# EasyEDA Pro project 驱动圆形屏幕测试板.eprj

# Schematic 原理图

## Sheets
1 主控MCU: Board Name: 转接隔离板; Create Date: 2024-04-22; Page Name: 主控MCU; Project Name: 测试板10+10; Schematic Name: 原理图; Update Date: 2025-04-10; Company: 嘉立创EDA; Page Size: A3; Version: V1.0
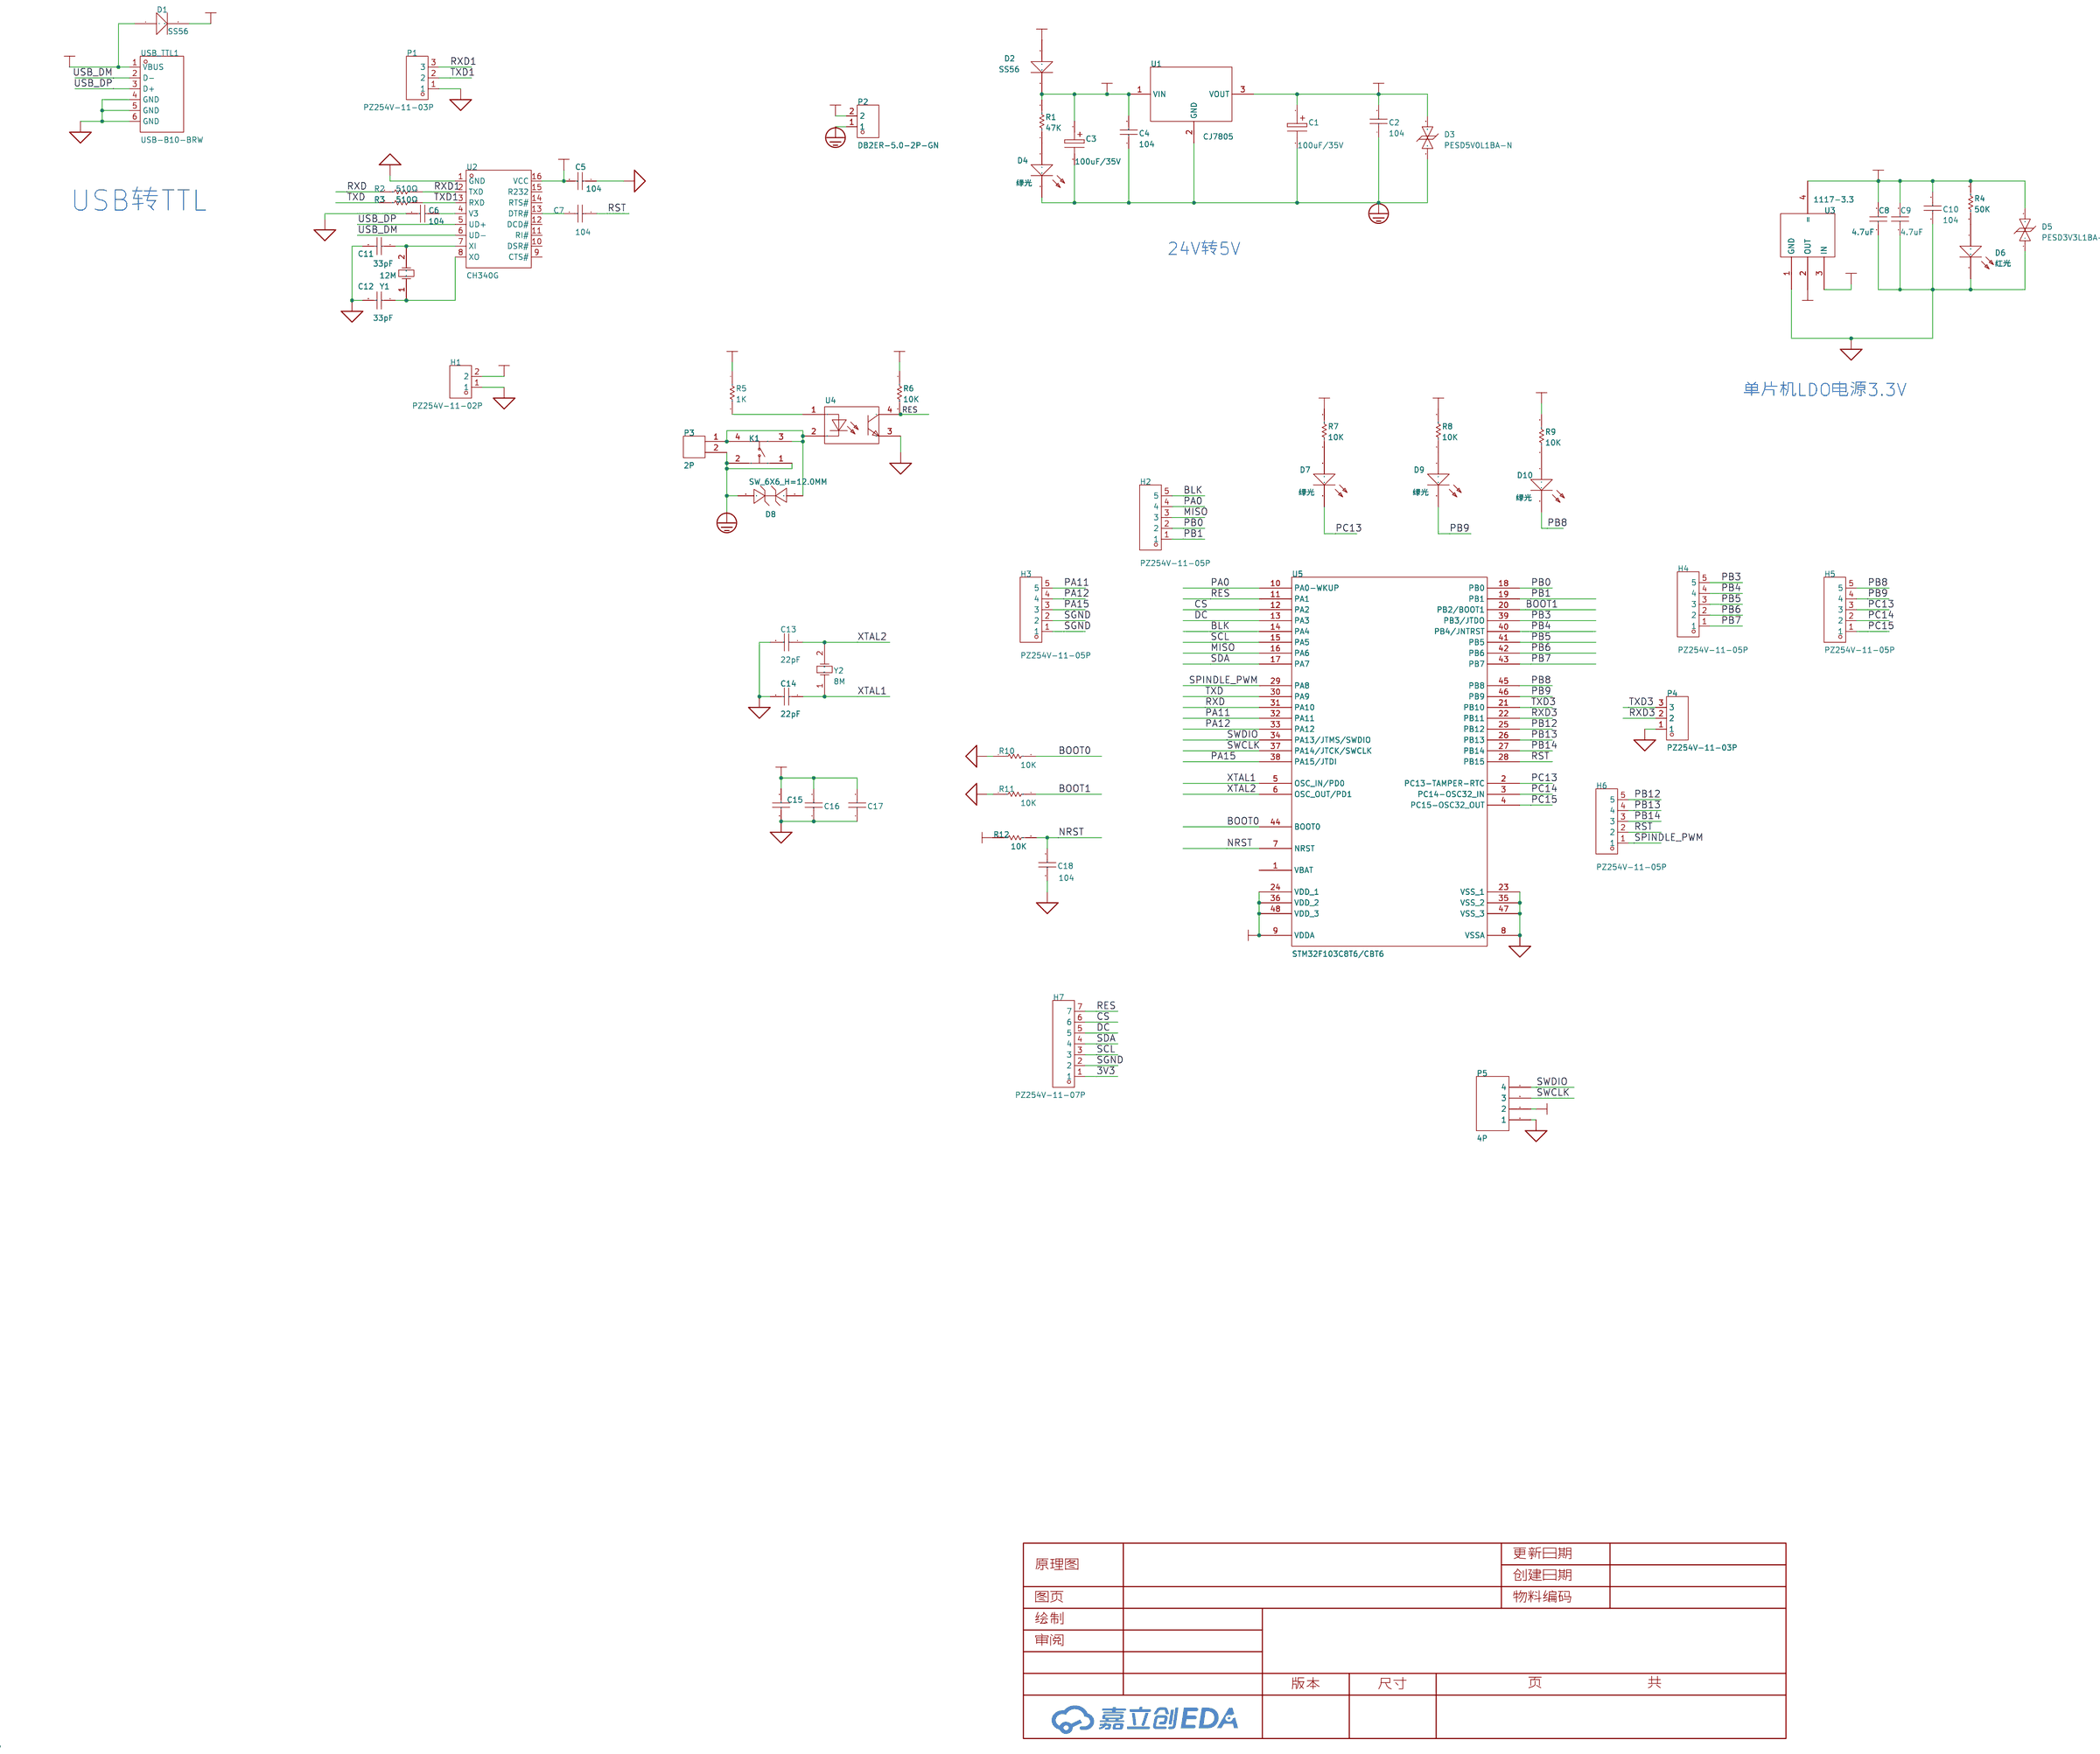
[diagram p0: 主控MCU]
2 电源及控制: Create Date: 2024-12-30; Page Name: 电源及控制; Project Name: 延时继电器; Update Date: 2025-04-08
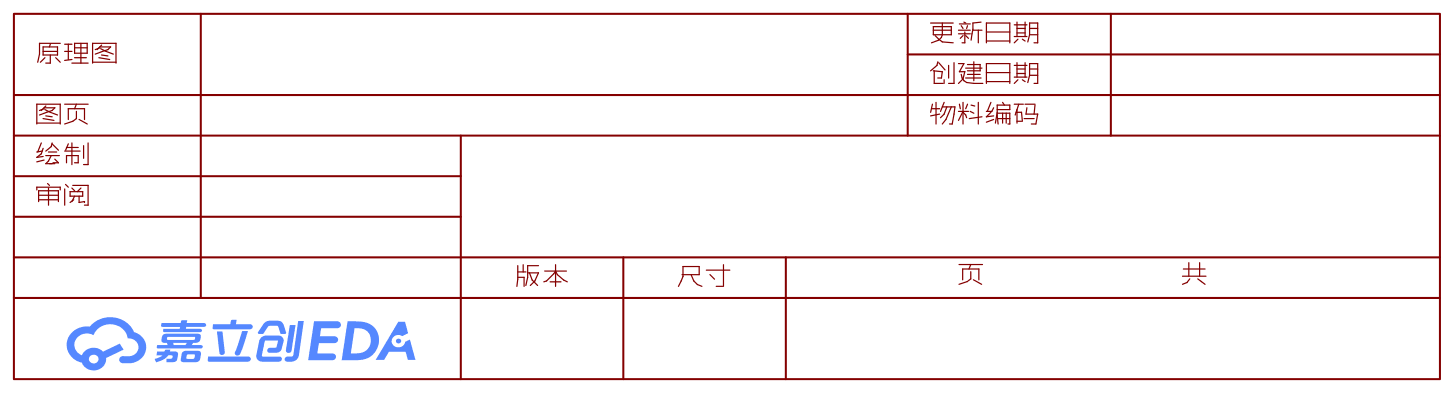
[diagram p1: 电源及控制]

## Parts
C1  100uF/35V  [电解电容贴片6X6]
C2  104  [0603C]
C3  100uF/35V  [电解电容贴片6X6]
C4  104  [0603C]
C5  104  [0603C]
C6  104  [0603C]
C7  104  [0805C]
C8  4.7uF  [C1206]
C9  4.7uF  [C1206]
C10  104  [0603C]
C11  18pF  [0603C]
C12  18pF  [0603C]
C13  100pF  [0603C]
C14  100pF  [0603C]
C15  104  [0603C]
C16  104  [0603C]
C17  104  [0603C]
C18  104  [0603C]
D1  SS56  [SMA]
D2  SS56  [SMA]
D3  PESD5V0L1BA-N  [SOD-523_L1.2-W0.8-LS1.6-BI]
D4  绿光  [0603LED]
D5  PESD3V3L1BA-N  [SOD-523_L1.2-W0.8-LS1.6-BI]
D6  红光  [0603LED]
D7  绿光  [0603LED]
D8  ESD05V52D-C  [SOD-523_L1.2-W0.8-LS1.6-BI]
D9  绿光  [0603LED]
D10  绿光  [0603LED]
H1  PZ254V-11-02P  [HDR-TH_2P-P2.54-V-M]
H2  PZ254V-11-05P  [HDR-TH_5P-P2.54-V-M]
H3  PZ254V-11-05P  [HDR-TH_5P-P2.54-V-M]
H4  PZ254V-11-05P  [HDR-TH_5P-P2.54-V-M]
H5  PZ254V-11-05P  [HDR-TH_5P-P2.54-V-M]
H6  PZ254V-11-05P  [HDR-TH_5P-P2.54-V-M]
H7  PZ254V-11-07P  [HDR-TH_7P-P2.54-V-M]
K1  SW_6X6_H=12.0MM  [KEY-SMD_4P-L6.0-W6.0-P4.50-LS9.0]
P1  PZ254V-11-03P  [HDR-TH_3P-P2.54-V-M]
P2  DB2ER-5.0-2P-GN  [CONN-TH_2P-P5.00_DB2ER-5.0-2P-GN]
P3  2P  [HDR1X2_CON]
P4  PZ254V-11-03P  [HDR-TH_3P-P2.54-V-M]
P5  4P  [SIP4]
R1  47K  [0603R]
R2  510Ω  [0603R]
R3  510Ω  [0603R]
R4  50K  [0603R]
R5  1K  [0603R]
R6  10K  [0603R]
R7  10K  [0603R]
R8  10K  [0603R]
R9  10K  [0603R]
R10  10K  [0603R]
R11  10K  [0603R]
R12  10K  [0603R]
U1  CJ7805  [TO-263-2]
U2  CH340G  [SOIC-16_L9.9-W3.9-P1.27-LS6.0-BL]
U3  1117-3.3  [SOT-223]
U4  LTV-357T-C  [SOP-4_L4.4-W3.9-P2.54-LS7.0-TL]
U5  STM32F103C8T6/CBT6  [LQFP48]
USB_TTL1  USB-B10-BRW  [USB-B-TH_USB-B12-BRW]
Y1  12M  [晶振贴片49SSMD]
Y2  8M  [晶振贴片]

## Library data of the parts
C1 C3 = 100uF/35V: Origin Footprint 2: X47U; Origin Footprint 1: 电解电容贴片6x6; Design Item ID: ELECTRO1; Library Name: *
C2 C4 C5 C10 = 104: Capacitor (Semiconductor SIM Model); Published: 8-Jun-2000; LatestRevisionDate: 17-Jul-2002; LatestRevisionNote: Re-released for DXP Platform.; PackageReference: C1206; Publisher: Altium Limited; Origin Footprint 2: C1206; Origin Footprint 3: 0402; Origin Footprint 4: 1310[0504]; Origin Footprint 5: 1608[0603]; Origin Footprint 6: C1210; Origin Footprint 7: C0805; Origin Footprint 8: C1206; Origin Footprint 9: 0805; Origin Footprint 10: 0805L; Design Item ID: Cap Semi; Library Name: Miscellaneous Devices
C6 = 103: Capacitor (Semiconductor SIM Model); Published: 8-Jun-2000; LatestRevisionDate: 17-Jul-2002; LatestRevisionNote: Re-released for DXP Platform.; PackageReference: C1206; Publisher: Altium Limited; Origin Footprint 2: C1206; Origin Footprint 3: 0402; Origin Footprint 4: 1310[0504]; Origin Footprint 5: 1608[0603]; Origin Footprint 6: C1210; Origin Footprint 7: C0805; Origin Footprint 8: C1206; Origin Footprint 9: 0805; Origin Footprint 10: 0805L; Design Item ID: Cap Semi; Library Name: Miscellaneous Devices
C7 = 104: Capacitor (Semiconductor SIM Model); Published: 8-Jun-2000; LatestRevisionDate: 17-Jul-2002; LatestRevisionNote: Re-released for DXP Platform.; PackageReference: C1206; Publisher: Altium Limited; Origin Footprint 2: C1206; Origin Footprint 3: 0402; Origin Footprint 4: 1310[0504]; Origin Footprint 5: 1608[0603]; Origin Footprint 6: C1210; Origin Footprint 7: C0805; Origin Footprint 8: C1206; Origin Footprint 9: 0805; Origin Footprint 10: 0805L; Origin Footprint 1: 0603C; Design Item ID: Cap Semi; Library Name: Miscellaneous Devices
C8 C9 = 104: Design Item ID: CAP; Library Name: SCH--װ--
C11 C12 = 33pF: Capacitor (Semiconductor SIM Model); Published: 8-Jun-2000; LatestRevisionDate: 17-Jul-2002; LatestRevisionNote: Re-released for DXP Platform.; PackageReference: C1206; Publisher: Altium Limited; Origin Footprint 2: C1206; Origin Footprint 3: 0402; Origin Footprint 4: 1310[0504]; Origin Footprint 5: 1608[0603]; Origin Footprint 6: C1210; Origin Footprint 7: C0805; Origin Footprint 8: C1206; Origin Footprint 9: 0805; Origin Footprint 10: 0805L; Design Item ID: Cap Semi; Library Name: Miscellaneous Devices
C13 C14 = 22pF: Capacitor (Semiconductor SIM Model); Published: 8-Jun-2000; LatestRevisionDate: 17-Jul-2002; LatestRevisionNote: Re-released for DXP Platform.; PackageReference: C1206; Publisher: Altium Limited; Origin Footprint 2: C1206; Origin Footprint 3: 0402; Origin Footprint 4: 1310[0504]; Origin Footprint 5: 1608[0603]; Origin Footprint 6: C1210; Origin Footprint 7: C0805; Origin Footprint 8: C1206; Origin Footprint 9: 0805; Origin Footprint 10: 0805L; Origin Footprint 11: 0805C; Design Item ID: Cap Semi; Library Name: Miscellaneous Devices
C15-C17 = 104: Origin Footprint 2: CAP; Origin Footprint 3: 0805C; Design Item ID: CAP; Library Name: SCH封装库
C18 = 104: Capacitor (Semiconductor SIM Model); Published: 8-Jun-2000; LatestRevisionDate: 17-Jul-2002; LatestRevisionNote: Re-released for DXP Platform.; PackageReference: C1206; Publisher: Altium Limited; Origin Footprint 2: C1206; Origin Footprint 3: 0402; Origin Footprint 4: 1310[0504]; Origin Footprint 5: 1608[0603]; Origin Footprint 6: C1210; Origin Footprint 7: C0805; Origin Footprint 8: C1206; Origin Footprint 9: 0805; Origin Footprint 10: 0805L; Origin Footprint 11: 0805C; Design Item ID: Cap Semi; Library Name: Miscellaneous Devices
D1 D2 = SS56: Design Item ID: 1N4148; Library Name: SCH封装库
D3 D5 = PESD5V0S1BBN: 极性:Bidirectional;反向关断电压（典型值）:5V (Max);击穿电压（最小值）:6V;箝位电压:15V;峰值脉冲电流（10/1000us）:5A (8/20us);; Supplier Part: C314264; Manufacturer: BORN伯恩半导体; Supplier Footprint: SOD-523; JLCPCB Part Class: Extended Part; Datasheet: https://atta.szlcsc.com/upload/public/pdf/source/20181015/C314264_F9AC5761AC2631DA841FBD1D9C6821E3.pdf; Supplier: LCSC; Polarity: Bidirectional; Voltage - Reverse Standoff (Typ): 5V (Max); Voltage - Breakdown (Min): 6V; Voltage - Clamping (Max) @ Ipp: 15V; Current - Peak Pulse (10/1000μs): 5A (8/20us)
D4 D7 D9 D10 = 绿光: Origin Footprint 2: LED(小); Design Item ID: LED; Library Name: SCH封装库
D6 = 红光: Origin Footprint 2: LED(小); Design Item ID: LED; Library Name: SCH封装库
D8 = ESD05V52D-C: 极性：双向 反向截止电压(Vrwm)：5V 击穿电压(VBR)：5.6V 钳位电压(Vc)@Ipp：15V 反向截止电压(Vrwm)：5V 击穿电压(最小值)：5.6V 峰值脉冲电流(Ipp)@tp=8/20μs：5A 最大钳位电压：15V; Supplier Part: C727170; Manufacturer: TWGMC(台湾迪嘉); Supplier Footprint: SOD-523; JLCPCB Part Class: 扩展库; Datasheet: https://atta.szlcsc.com/upload/public/pdf/source/20200827/C727170_700AFDE065FF081A69A0C04747B3686A.pdf; Supplier: LCSC
H1 = PZ254V-11-02P: 插针结构:1x2P;间距:2.54mm;行距:-;圆针/方针:方针;安装类型:直插;排数:单排;总PIN位数:2P;额定电流:-;额定电压:-;配合针长度:6mm;塑高:2.5mm;端接针长度:3mm;触头材质:黄铜;触头镀层:-;工作温度范围:-40℃~+105℃;颜色:黑色;; LCSC Part Name: 间距:2.54mm 1x2P 直插 方针; Supplier Part: C492401; Manufacturer: XFCN(兴飞); Supplier Footprint: 插件,P=2.54mm; JLCPCB Part Class: 扩展库; Datasheet: https://atta.szlcsc.com/upload/public/pdf/source/20200309/C492401_A812433581A9B211A7FFA413ADDFF0E5.pdf; Supplier: LCSC; Pin Structure: 1x2P; Pitch: 2.54mm; Circluar Pins/Square Pins: 方针; Mounting Type: 直插; Number of Rows: 单排; Number of Pins: 2P; Length of Mating Pin: 6mm; Insulation Height: 2.5mm; Length of End Connection Pin: 3mm; Contact Material: 黄铜; Operating Temperature Range: -40℃~+105℃; Color: 黑色
H2-H6 = PZ254V-11-05P: LCSC Part Name: 2.54mm 1x5P 直插 方针; Supplier Part: C492404; Manufacturer: XFCN(兴飞); Supplier Footprint: 直插,P=2.54mm; JLCPCB Part Class: Extended Part; Datasheet: https://atta.szlcsc.com/upload/public/pdf/source/20200309/C492404_E51533260F8710EFF5D4617281164C1D.pdf; Supplier: LCSC; Pitch: 2.54mm; Number of Pins: 5; Number of Rows: 1; Pin Structure: 1x5P; Mounting Type: 直插; Circluar Pins/Square Pins: 方针; Length of Mating Pin: 6mm; Insulation Height: 2.5mm; Length of End Connection Pin: 3mm; Contact Material: 黄铜; Operating Temperature Range: -40℃~+105℃; Color: 黑色
H7 = PZ254V-11-07P: LCSC Part Name: 2.54mm 1x7P 直插 方针; Supplier Part: C492406; Manufacturer: XFCN(兴飞); Supplier Footprint: 直插,P=2.54mm; JLCPCB Part Class: Extended Part; Datasheet: https://atta.szlcsc.com/upload/public/pdf/source/20200309/C492406_654C533EE691117E22DD9F76C114C2D9.pdf; Supplier: LCSC; Pitch: 2.54mm; Number of Pins: 7; Number of Rows: 1; Pin Structure: 1x7P; Mounting Type: 直插; Circluar Pins/Square Pins: 方针; Length of Mating Pin: 6mm; Insulation Height: 2.5mm; Length of End Connection Pin: 3mm; Contact Material: 黄铜; Operating Temperature Range: -40℃~+105℃; Color: 黑色
K1 = SW_6X6_H=12.0MM: Supplier Part: C9900018802; Supplier Footprint: KEY-SMD; JLCPCB Part Class: 扩展库; Supplier: LCSC
P1 P4 = PZ254V-11-03P: 插针结构:1x3P;间距:2.54mm;行距:-;圆针/方针:方针;安装类型:直插;排数:单排;总PIN位数:3P;额定电流:3A;额定电压:250V;配合针长度:6mm;塑高:2.5mm;端接针长度:3mm;工作温度范围:-40℃~+105℃;颜色:黑色;; LCSC Part Name: 间距:2.54mm 1x3P 直插 方针; Supplier Part: C2937625; Manufacturer: XFCN(兴飞); Supplier Footprint: 插件,P=2.54mm; JLCPCB Part Class: 扩展库; Datasheet: https://atta.szlcsc.com/upload/public/pdf/source/20200309/C492402_8335C3D49C4E4C618838D59BB1D024C1.pdf; Supplier: LCSC; Pin Structure: 1x3P; Pitch: 2.54mm; Circluar Pins/Square Pins: 方针; Mounting Type: 直插; Number of Rows: 单排; Number of Pins: 3P; Current Rating (Max): 3A; Voltage Rating (Max): 250V; Length of Mating Pin: 6mm; Insulation Height: 2.5mm; Length of End Connection Pin: 3mm; Operating Temperature Range: -40℃~+105℃; Color: 黑色
P2 = DB2ER-5.0-2P-GN: 间距:5mm;颜色:绿色;排数:1;每排PIN数:2;额定电流:15A;额定电压:630V;触头镀层:锡;; LCSC Part Name: 5mm排数:1每排P数:2; Supplier Part: C5454428; Manufacturer: DORABO(地博电气); Supplier Footprint: P=5mm; JLCPCB Part Class: 扩展库; Datasheet: https://atta.szlcsc.com/upload/public/pdf/source/20230427/39CC0BD2D36F5E0FC60100946C6C8B3A.pdf; Supplier: LCSC; Pitch: 5mm; Color: 绿色; Number of Pins: 2P; Number of Rows: 1; Number of PINs Per Row: 2; Current Rating (Max): 15A; Voltage Rating (Max): 630V; Contact Plating: 锡
P3 = 2P: Library Name: SCH--װ--
P5 = 4P: Library Name: SCH--װ--
R1 R4 R7-R9 = 1K: Resistor; Published: 8-Jun-2000; LatestRevisionDate: 17-Jul-2002; LatestRevisionNote: Re-released for DXP Platform.; PackageReference: AXIAL-0.3; Publisher: Altium Limited; Origin Footprint 2: AXIAL-0.3; Origin Footprint 3: R0805; Origin Footprint 4: 0805R; Design Item ID: RES; Library Name: SCH封装库
R2 = 680!!: Resistor; Published: 8-Jun-2000; LatestRevisionDate: 17-Jul-2002; LatestRevisionNote: Re-released for DXP Platform.; PackageReference: AXIAL-0.3; Publisher: Altium Limited; Origin Footprint 2: AXIAL-0.3; Origin Footprint 3: R0805; Origin Footprint 4: 0805R; Design Item ID: RES; Library Name: SCH封装库
R3 = 100: Resistor; Published: 8-Jun-2000; LatestRevisionDate: 17-Jul-2002; LatestRevisionNote: Re-released for DXP Platform.; PackageReference: AXIAL-0.3; Publisher: Altium Limited; Origin Footprint 2: AXIAL-0.3; Origin Footprint 3: R0805; Origin Footprint 4: 0805R; Design Item ID: RES; Library Name: SCH封装库
R5 = 470Ω: Resistor; Published: 8-Jun-2000; LatestRevisionDate: 17-Jul-2002; LatestRevisionNote: Re-released for DXP Platform.; PackageReference: AXIAL-0.3; Publisher: Altium Limited; Origin Footprint 2: AXIAL-0.3; Origin Footprint 3: R0805; Origin Footprint 4: 0805R; Design Item ID: RES; Library Name: SCH封装库
R6 = 10K: Resistor; Published: 8-Jun-2000; LatestRevisionDate: 17-Jul-2002; LatestRevisionNote: Re-released for DXP Platform.; PackageReference: AXIAL-0.3; Publisher: Altium Limited; Origin Footprint 2: AXIAL-0.3; Origin Footprint 3: R0805; Origin Footprint 4: 0805R; Design Item ID: RES; Library Name: SCH封装库
R10-R12 = 10K: Resistor; Published: 8-Jun-2000; LatestRevisionDate: 17-Jul-2002; LatestRevisionNote: Re-released for DXP Platform.; PackageReference: AXIAL-0.3; Publisher: Altium Limited; Origin Footprint 2: AXIAL-0.3; Origin Footprint 3: 0805R; Origin Footprint 4: 0805R; Design Item ID: RES; Library Name: SCH封装库
U1 = CJ7805: Design Item ID: 7805; Library Name: SCH封装库
U2 = CH340G: 应用功能:收发器;接口协议:USB 2.0;数据速率:2Mbps;; LCSC Part Name: USB转串口芯片 CH340; Supplier Part: C14267; Manufacturer: WCH(南京沁恒); Supplier Footprint: SOP-16; JLCPCB Part Class: 扩展库; Datasheet: https://atta.szlcsc.com/upload/public/pdf/source/20230530/6E401E9554E9F5311886CC8B3F89B62E.pdf; Supplier: LCSC; Applications Function: 收发器; Protocol: USB 2.0; Supply Voltage: 3.3V；5V; Data Rate: 2Mbps
U3 = 1117-3.3: Design Item ID: LM1117; Library Name: Party600
U4 = LTV-357T-C: 输入电压类型:DC;正向电压:1.2V;输出电流:50mA;隔离电压(rms):3.75kV;反向电压:6V;接收端电压:35V;输出通道数:1;集射极饱和电压(Vce(sat)@Ic,IF):200mV@1mA,20mA;; Supplier: LCSC; Manufacturer: LITEON(光宝); Supplier Part: C119091; JLCPCB Part Class: 扩展库; LCSC Part Name: DC输入隔离电压(rms):3750V; Supplier Footprint: SOP-4-2.54mm; Datasheet: https://atta.szlcsc.com/upload/public/pdf/source/20170930/C133128_1506736380934997376.pdf; Input voltage type: DC; Output Type: 光电三极管; Forward Voltage: 1.2V; Output Current: 50mA; Isolation Voltage(rms): 3.75kV; Reverse Voltage: 6V; Receiving End Voltage: 35V; Number of Outputs: 1; Collector-Emitter Saturation Voltage (Vce(sat)@Ic,IF): 200mV@1mA,20mA; Rise time: 4us@2mA,100Ω; Fall time: 3us@2mA,100Ω; Operating Temperature: -55℃~+110℃
U5 = STM32F103C8T6/CBT6: STM32 ARM-based 32-bit MCU with 32 Kbytes Flash, 48-pin LQFP, Industrial Temperature; Published: *; DatasheetVersion: *; PackageVersion: *; PackageReference: *; Publisher: *; PackageDescription: *; ComponentLink1Description: *; ComponentLink1URL: *; ComponentLink2Description: *; ComponentLink2URL: *; Origin Footprint 2: LQFP48_L; Origin Footprint 3: LQFP48_M; Design Item ID: STM32F103C6T6; Library Name: ST Microcontroller 32-Bit STM32 SCH
USB_TTL1 = USB-B10-BRW: 连接器类型:Type-B;标准:USB 2.0;公母:母;端口数量:1;触点数量:4P;安装方式:弯插;额定电流 - 电源:1.5A;工作温度范围:-20℃~+70℃;焊接温度(最大值):260℃;; LCSC Part Name: Type-B母弯插; Supplier Part: C720549; Manufacturer: XUNPU(讯普); Supplier Footprint: 插件; JLCPCB Part Class: 扩展库; Datasheet: https://atta.szlcsc.com/upload/public/pdf/source/20200812/C720549_53E9294752E2933874870440E626C579.pdf; Supplier: LCSC; Connector Type: Type-B; Standard: USB2.0; Gender: 母; Number of Ports: 1; Number of Contacts: 4P; Mounting Style: 弯插; Current Rating - Power (Max): 1.5A; Operating Temperature Range: -20℃~+70℃; Soldering Temperature(Max): 260℃
Y1 = 12M: Crystal Oscillator; Published: 8-Jun-2000; LatestRevisionDate: 17-Jul-2002; LatestRevisionNote: Re-released for DXP Platform.; PackageReference: R38; Publisher: Altium Limited; Origin Footprint 2: R38; Origin Footprint 3: XTAL-49S; Design Item ID: XTAL; Library Name: Miscellaneous Devices
Y2 = 8M: Crystal Oscillator; Published: 8-Jun-2000; LatestRevisionDate: 17-Jul-2002; LatestRevisionNote: Re-released for DXP Platform.; PackageReference: R38; Publisher: Altium Limited; Origin Footprint 2: R38; Origin Footprint 3: XTAL-49S; Design Item ID: XTAL; Library Name: Miscellaneous Devices

## Nets
3V3: C8.2 C9.2 C10.2 C15.2 C16.2 C17.2 D5.2 H7.1 P5.2 R4.1 R6.1 R7.2 R8.2 R9.2 R12.1 U3.2(OUT) U3.4(=) U5.9(VDDA) U5.24(VDD_1) U5.36(VDD_2) U5.48(VDD_3)
5V_VCC: C1.1 C2.2 C5.2 D1.2 D3.2 H1.2 R5.1 U1.3(VOUT) U2.16(VCC) U3.3(IN)
24V: D2.1 P2.2
SGND: C1.2 C2.1 C3.2 C4.1 C5.1 C6.2 C8.1 C9.1 C10.1 C11.2 C12.2 C13.2 C14.2 C15.1 C16.1 C17.1 C18.1 D3.1 D4.2 D5.1 D6.2 D8.1 H1.1 H3.1 H3.2 H7.2 K1.1 K1.2 P1.1 P2.1 P3.2 P4.1 P5.1 R10.1 R11.1 U1.2(GND) U2.1(GND) U3.1(GND) U4.3 U5.8(VSSA) U5.23(VSS_1) U5.35(VSS_2) U5.47(VSS_3) USB_TTL1.4(GND) USB_TTL1.5(GND) USB_TTL1.6(GND)
VIN_24V: C3.1 C4.2 D2.2 R1.2 U1.1(VIN)
BLK: H2.5 U5.14(PA4)
BOOT0: R10.2 U5.44(BOOT0)
BOOT1: R11.2 U5.20(PB2/BOOT1)
CS: H7.6 U5.12(PA2)
DC: H7.5 U5.13(PA3)
MISO: H2.3 U5.16(PA6)
NRST: C18.2 R12.2 U5.7(NRST)
PA0: H2.4 U5.10(PA0-WKUP)
PA11: H3.5 U5.32(PA11)
PA12: H3.4 U5.33(PA12)
PA15: H3.3 U5.38(PA15/JTDI)
PB0: H2.2 U5.18(PB0)
PB1: H2.1 U5.19(PB1)
PB3: H4.5 U5.39(PB3/JTDO)
PB4: H4.4 U5.40(PB4/JNTRST)
PB5: H4.3 U5.41(PB5)
PB6: H4.2 U5.42(PB6)
PB7: H4.1 U5.43(PB7)
PB8: D10.2 H5.5 U5.45(PB8)
PB9: D9.2 H5.4 U5.46(PB9)
PB12: H6.5 U5.25(PB12)
PB13: H6.4 U5.26(PB13)
PB14: H6.3 U5.27(PB14)
PC13: D7.2 H5.3 U5.2(PC13-TAMPER-RTC)
PC14: H5.2 U5.3(PC14-OSC32_IN)
PC15: H5.1 U5.4(PC15-OSC32_OUT)
RES: H7.7 R6.2 U4.4 U5.11(PA1)
RST: C7.2 H6.2 U5.28(PB15)
RXD: R2.2 U5.31(PA10)
RXD1: P1.3 R2.1 U2.2(TXD)
RXD3: P4.2 U5.22(PB11)
SCL: H7.3 U5.15(PA5)
SDA: H7.4 U5.17(PA7)
SPINDLE_PWM: H6.1 U5.29(PA8)
SWCLK: P5.3 U5.37(PA14/JTCK/SWCLK)
SWDIO: P5.4 U5.34(PA13/JTMS/SWDIO)
TXD: R3.2 U5.30(PA9)
TXD1: P1.2 R3.1 U2.3(RXD)
TXD3: P4.3 U5.21(PB10)
USB_DM: U2.6(UD-) USB_TTL1.2(D-)
USB_DP: U2.5(UD+) USB_TTL1.3(D+)
VUSB: D1.1 USB_TTL1.1(VBUS)
XTAL1: C14.1 U5.5(OSC_IN/PD0) Y2.1(OSC1)
XTAL2: C13.1 U5.6(OSC_OUT/PD1) Y2.2(OSC2)
$1N53807: D10.1 R9.1
$1N55881: D6.1 R4.2
$1N62733: D4.1 R1.1
$1N62788: D7.1 R7.1
$1N65547: D9.1 R8.1
$1N70398: R5.2 U4.1
$1N71038: C6.1 U2.4(V3)
$1N71041: C7.1 U2.13(DTR#)
$1N71051: C11.1 U2.7(XI) Y1.2(OSC2)
$1N71052: C12.1 U2.8(XO) Y1.1(OSC1)
$1N72249: D8.2 K1.3 K1.4 P3.1 U4.2

Not connected (* = marked no-connect by the designer): U2 9(CTS#) 10(DSR#) 11(RI#) 12(DCD#) 14(RTS#) 15(R232); U5 1(VBAT)

## Notes on the sheets
sheet 1
- USB转TTL
- 24V转5V
- 单片机LDO电源3.3V

# Board PCB
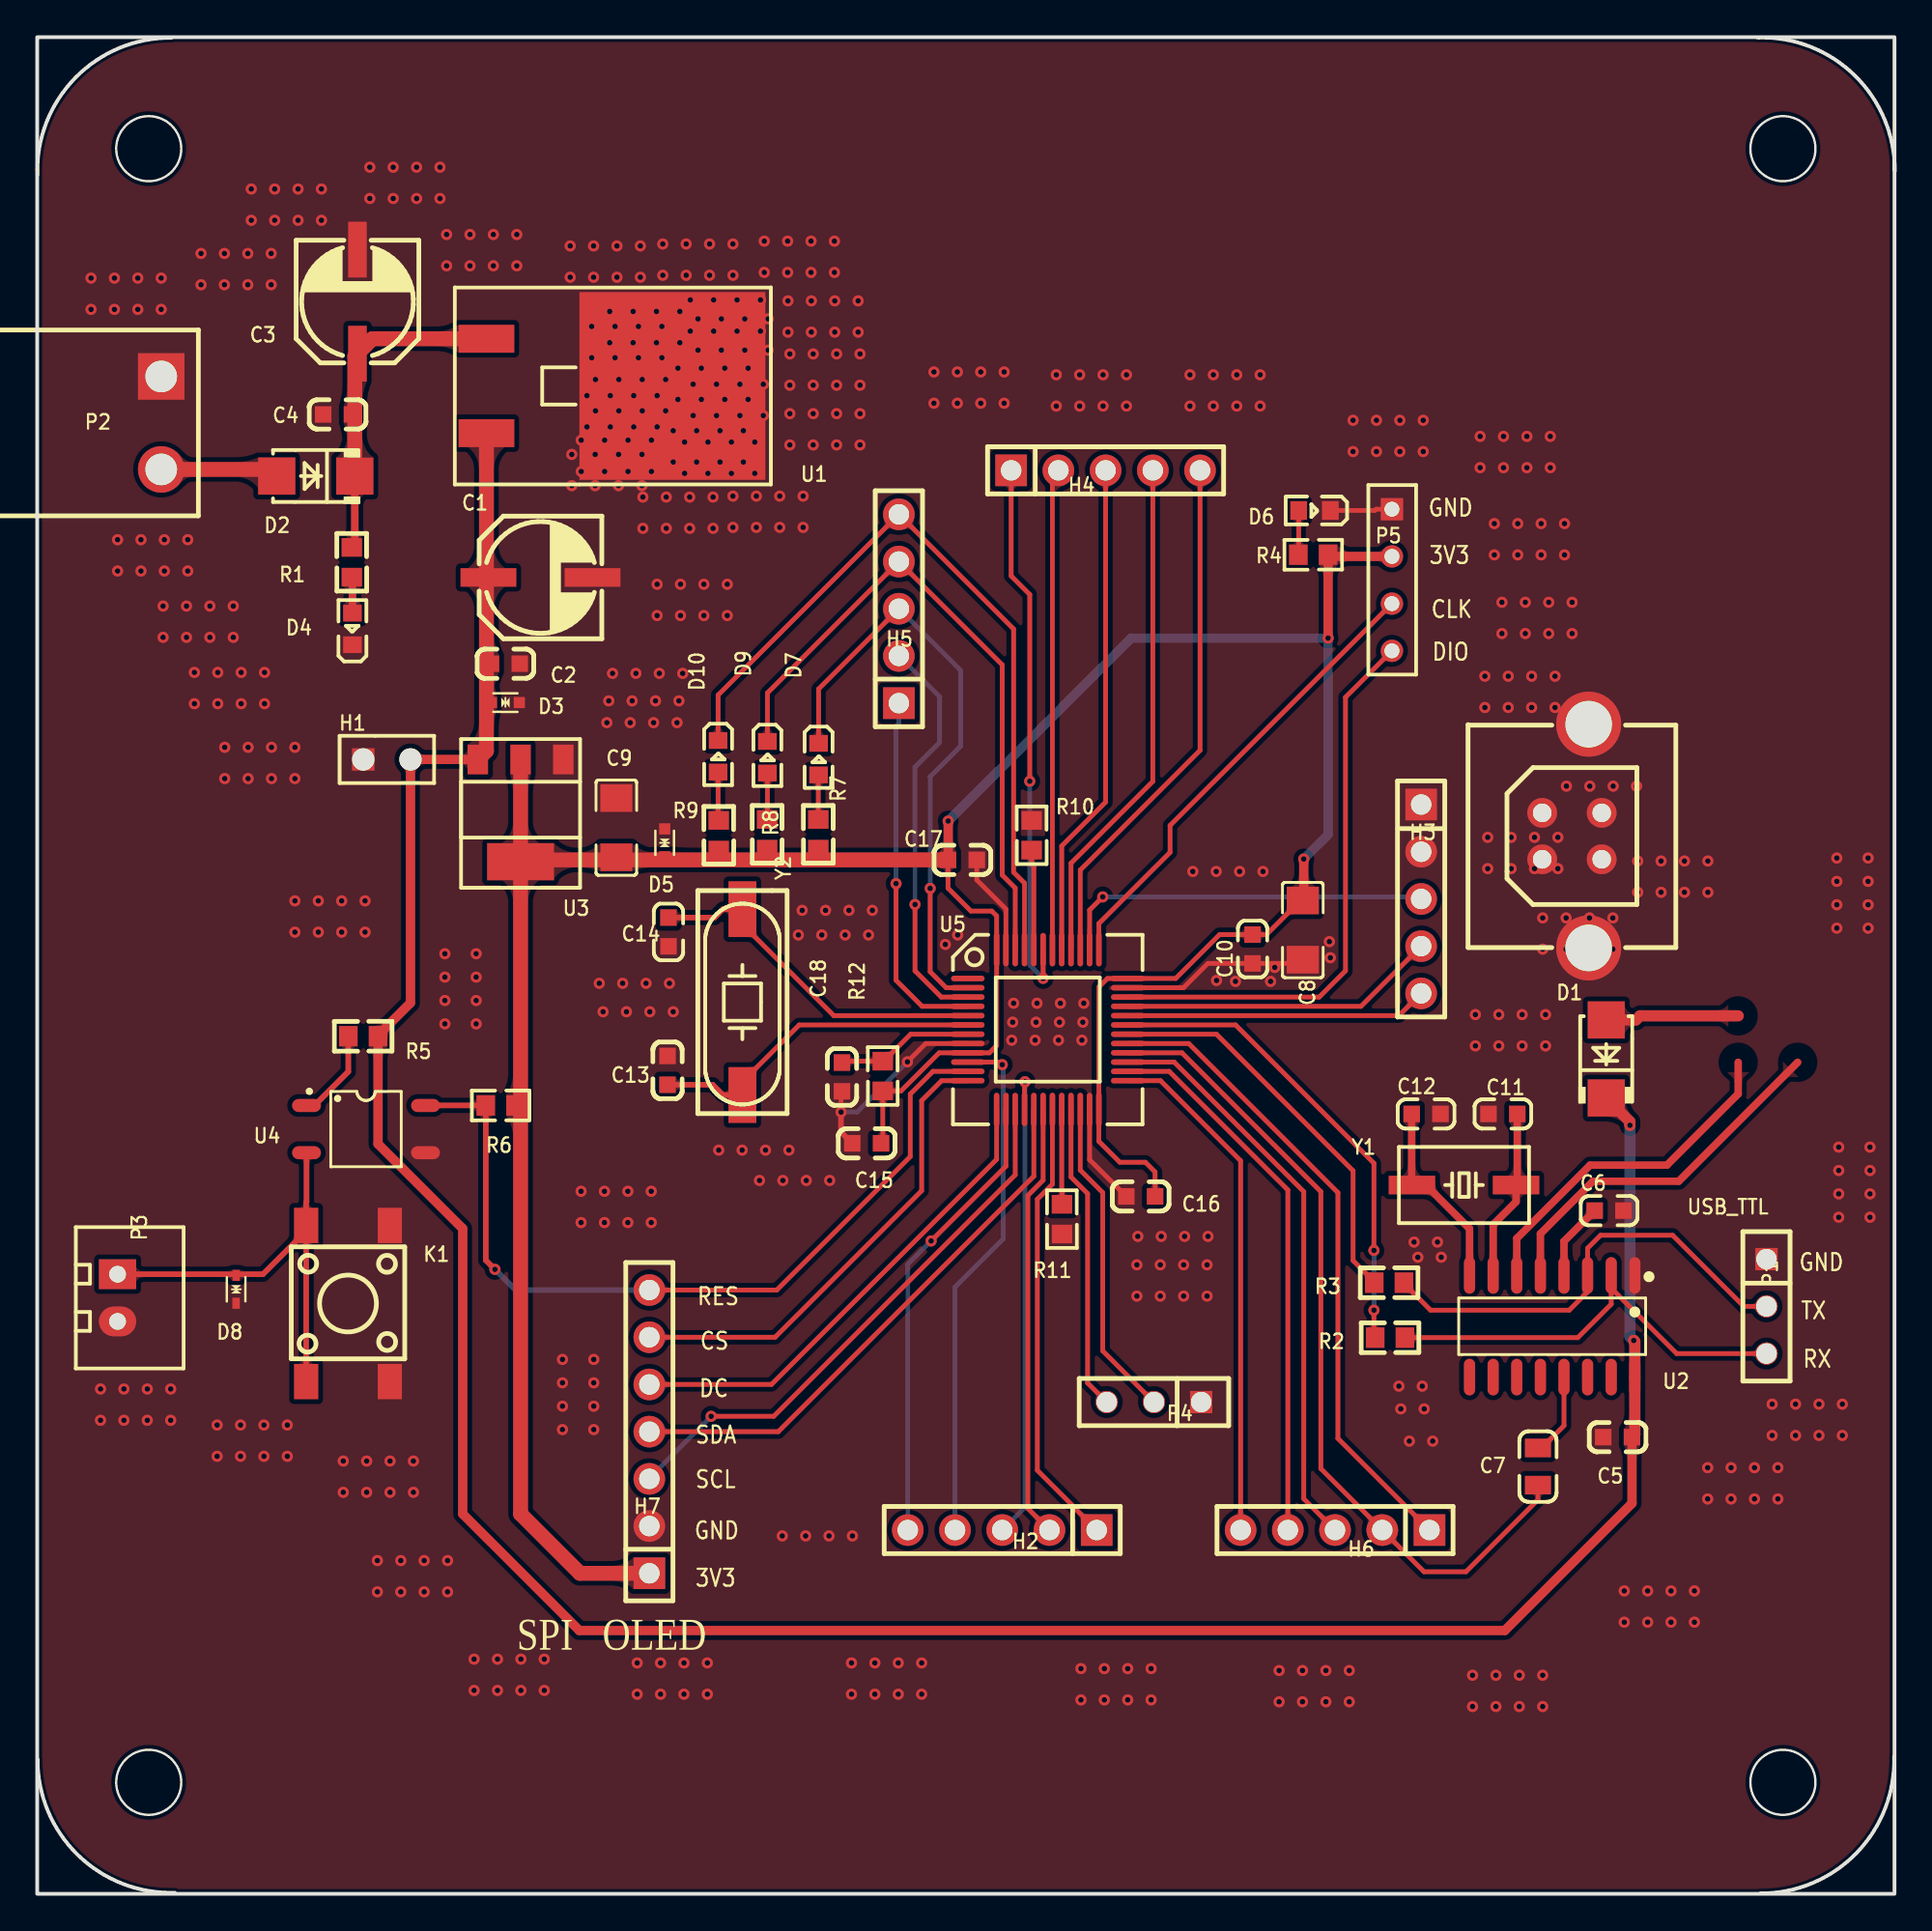
[diagram p2: board, top side]
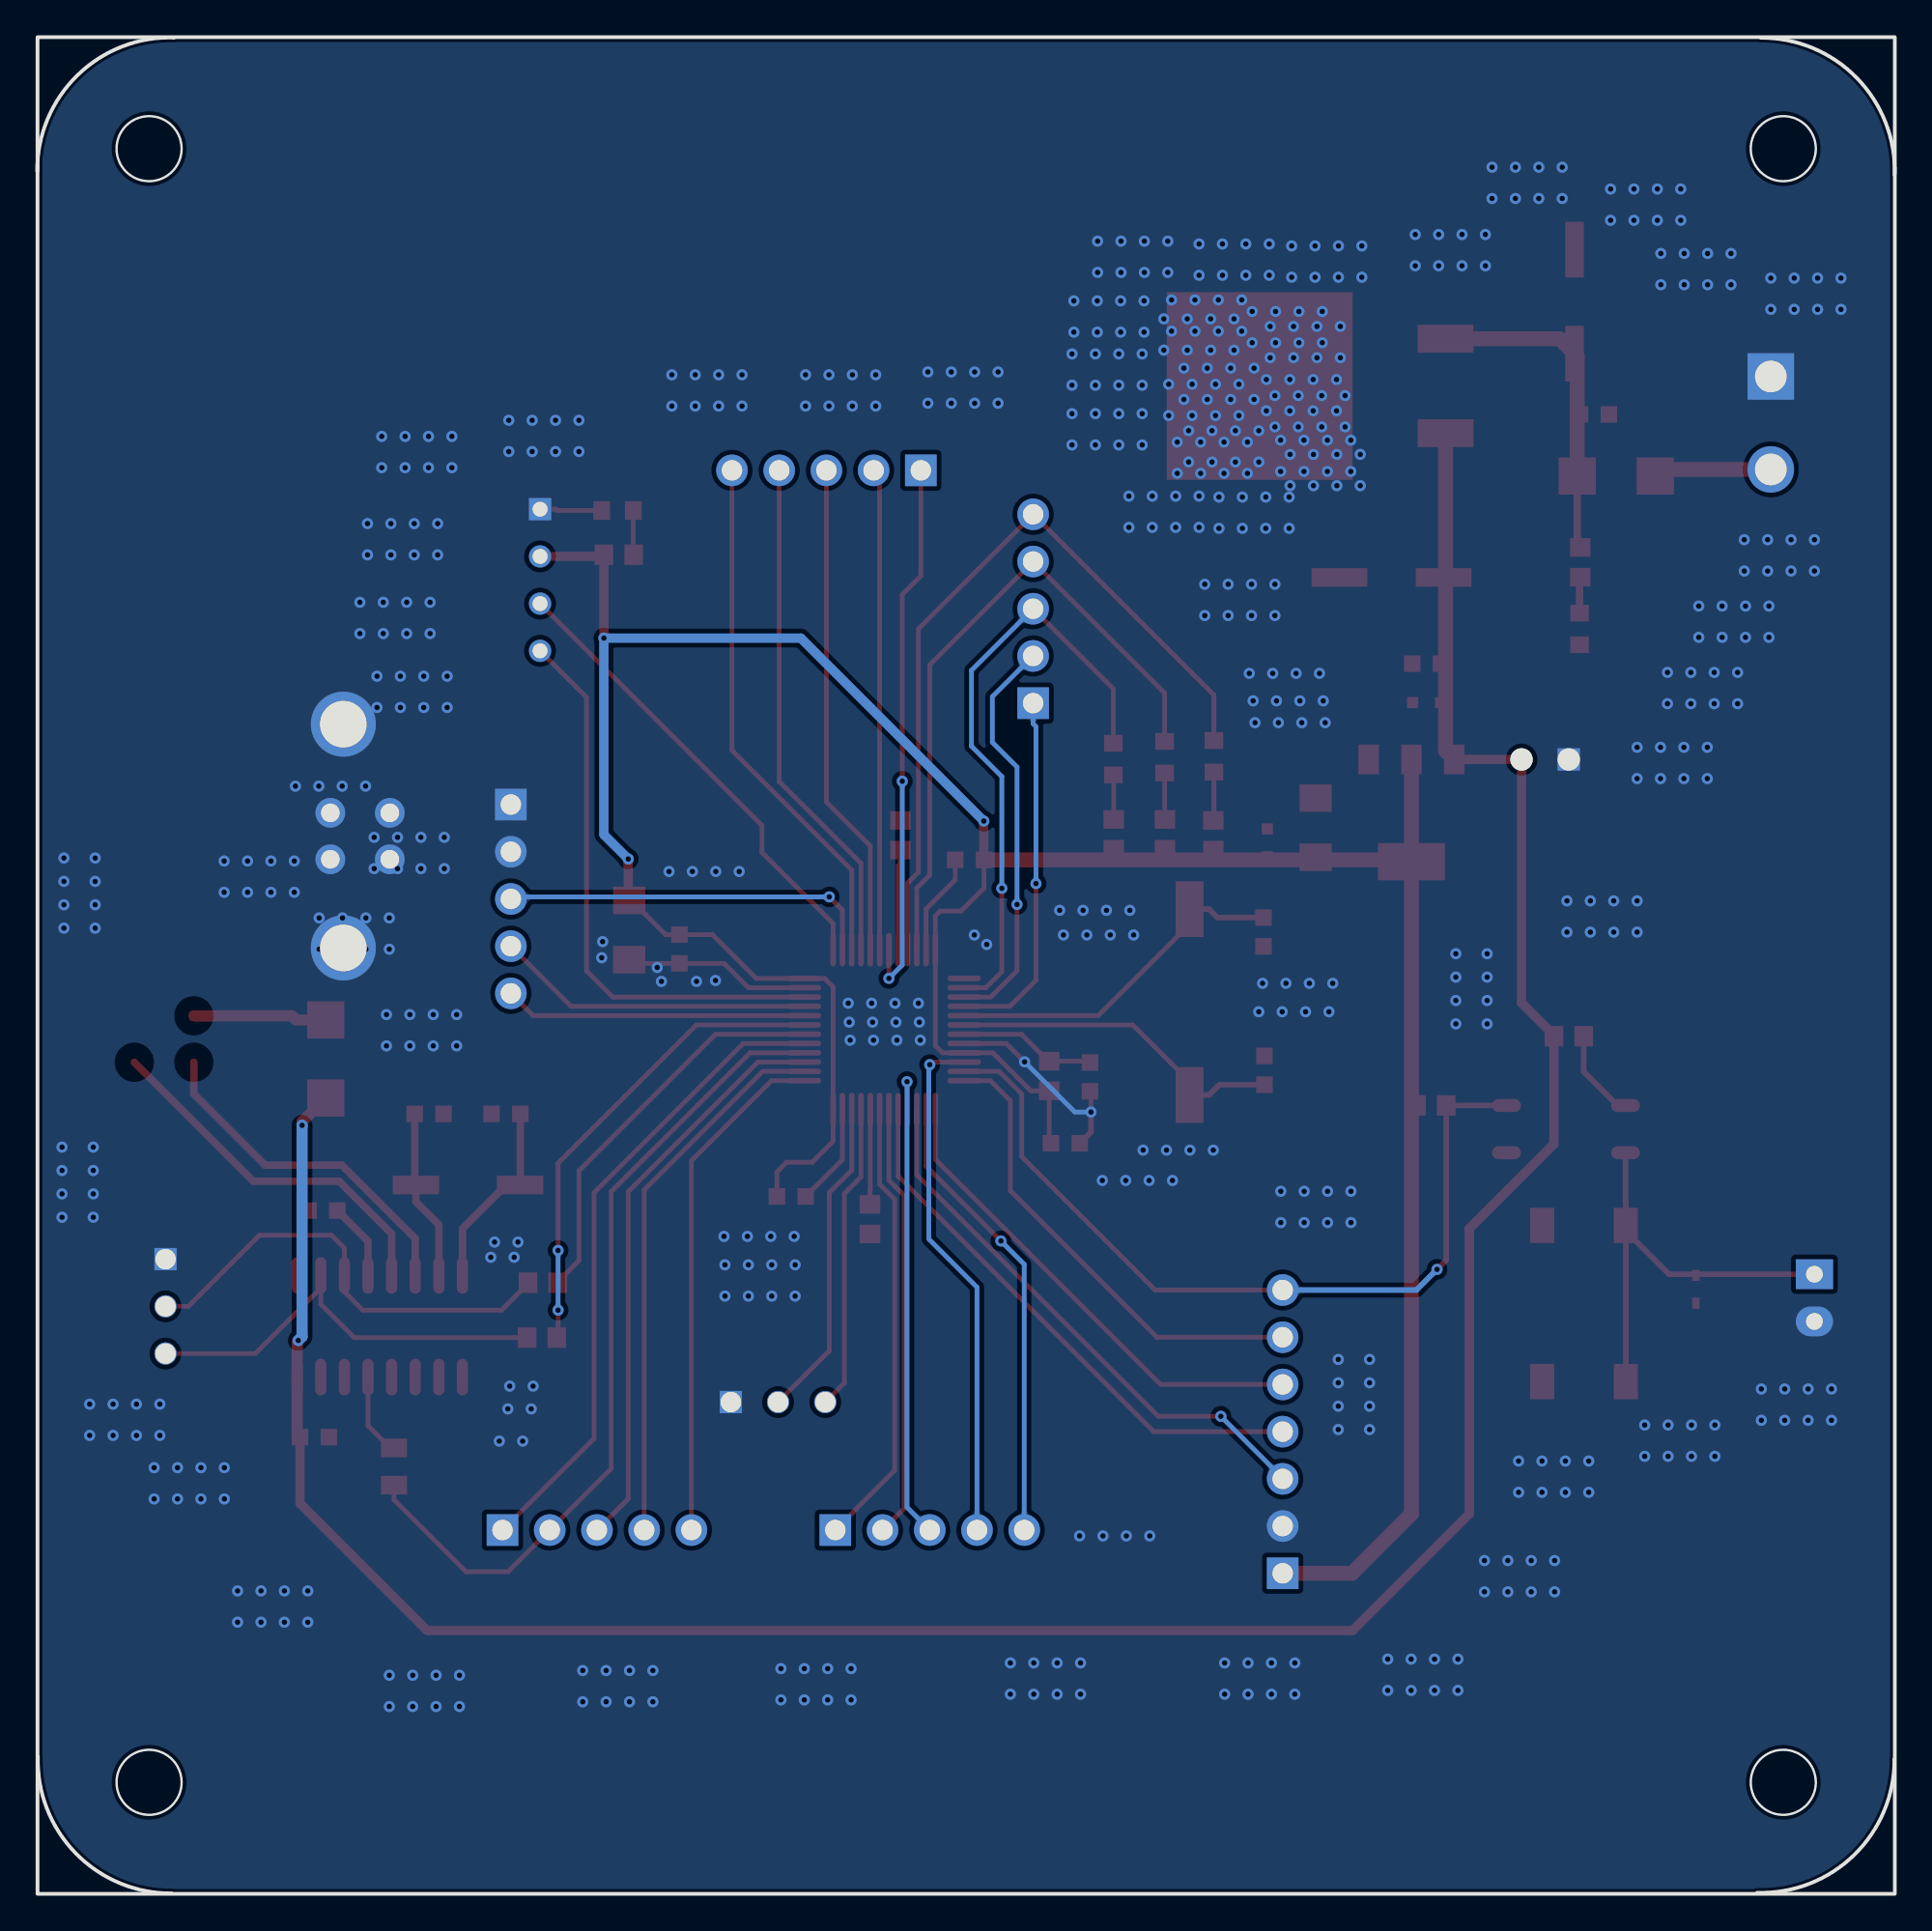
[diagram p3: board, bottom side, seen from below]

Outline 99.92 x 99.9 mm; copper layers: Top Layer, Bottom Layer. Coordinates in mm from the lower left corner of the outline.
Outline path: rectangle 0,99.9 99.9,0 ; circle c6,93.9 r1.75 ; circle c6,6 r1.75 ; circle c93.9,93.9 r1.75 ; circle c93.9,6 r1.75 ; 0.01,92.49 arc(2.04,97.7) 7.2,99.87 ; 7.4,0.06 arc(2.19,2.09) 0.02,7.25 ; 92.54,99.88 arc(97.75,97.85) 99.92,92.69 ; 99.88,7.4 arc(97.85,2.19) 92.69,0.02
Stack: Top Layer 0.035mm / Dielectric1 1.51mm FR4 er 4.5 / Bottom Layer 0.035mm

## Design rules (mm)
template: 用户自定义配置
spacing Default (default): track to track 0.152, other pairs 0 to 0.152
track width Default (default): min 0.254, default 0.254, max 25.4
differential pair differentialPair (default): width min 0.127, default 0.254, max 2.54; gap min 0.152, default 0.152
via Default (default): diameter min 0.25, default 0.61, max 100.025; hole min 0.2, default 0.305, max 59.995

## Placement (name value [footprint] x y rotation side)
C1  100uF/35V  [电解电容贴片6X6]  27.07 70.83 0 top
C2  104  [0603C]  25.18 66.19 180 top
C3  100uF/35V  [电解电容贴片6X6]  17.23 85.67 90 top
C4  104  [0603C]  16.16 79.6 0 top
C5  104  [0603C]  85.01 24.57 0 top
C6  104  [0603C]  84.55 36.76 0 top
C7  104  [0805C]  80.72 22.99 270 top
C8  4.7uF  [C1206]  68.08 51.86 90 top
C9  4.7uF  [C1206]  31.15 57.37 270 top
C10  104  [0603C]  65.37 50.84 90 top
C11  18pF  [0603C]  78.84 41.96 180 top
C12  18pF  [0603C]  74.71 41.96 0 top
C13  100pF  [0603C]  33.91 44.31 90 top
C14  100pF  [0603C]  33.96 51.76 270 top
C15  104  [0603C]  44.62 40.38 0 top
C16  104  [0603C]  59.35 37.53 0 top
C17  104  [0603C]  49.77 55.63 180 top
C18  104  [0603C]  43.29 43.95 90 top
D1  SS56  [SMA]  84.4 44.92 90 top
D2  SS56  [SMA]  14.98 76.29 180 top
D3  PESD5V0L1BA-N  [SOD-523_L1.2-W0.8-LS1.6-BI]  25.18 64.1 180 top
D4  绿光  [0603LED]  16.97 68.02 270 top
D5  PESD3V3L1BA-N  [SOD-523_L1.2-W0.8-LS1.6-BI]  33.75 56.55 270 top
D6  红光  [0603LED]  68.74 74.45 0 top
D7  绿光  [0603LED]  42.01 61.09 90 top
D8  ESD05V52D-C  [SOD-523_L1.2-W0.8-LS1.6-BI#2]  10.7 32.53 90 top
D9  绿光  [0603LED]  39.26 61.19 90 top
D10  绿光  [0603LED]  36.61 61.24 90 top
H1  PZ254V-11-02P  [HDR-TH_2P-P2.54-V-M]  18.81 61.04 0 top
H2  PZ254V-11-05P  [HDR-TH_5P-P2.54-V-M]  51.91 19.57 180 top
H3  PZ254V-11-05P  [HDR-TH_5P-P2.54-V-M]  74.44 53.53 270 top
H4  PZ254V-11-05P  [HDR-TH_5P-P2.54-V-M]  57.47 76.59 0 top
H5  PZ254V-11-05P  [HDR-TH_5P-P2.54-V-M]  46.35 69.15 90 top
H6  PZ254V-11-05P  [HDR-TH_5P-P2.54-V-M]  69.81 19.57 180 top
H7  PZ254V-11-07P  [HDR-TH_7P-P2.54-V-M]  32.93 24.87 90 top
K1  SW_6X6_H=12.0MM  [KEY-SMD_4P-L6.0-W6.0-P4.50-LS9.0]  16.72 31.76 270 top
P1  PZ254V-11-03P  [HDR-TH_3P-P2.54-V-M]  93.01 31.61 270 top
P2  DB2ER-5.0-2P-GN  [CONN-TH_2P-P5.00_DB2ER-5.0-2P-GN]  6.67 79.14 270 top
P3  2P  [HDR1X2_CON]  4.32 32.07 270 top
P4  PZ254V-11-03P  [HDR-TH_3P-P2.54-V-M]  60.07 26.46 180 top
P5  4P  [SIP4]  72.87 74.5 270 top
R1  47K  [0603R]  16.92 71.65 90 top
R2  510Ω  [0603R]  72.77 29.93 180 top
R3  510Ω  [0603R]  72.72 32.89 180 top
R4  50K  [0603R]  68.64 72.05 180 top
R5  1K  [0603R]  17.53 46.15 180 top
R6  10K  [0603R]  24.93 42.42 180 top
R7  10K  [0603R]  42.01 57.01 270 top
R8  10K  [0603R]  39.26 57.01 270 top
R9  10K  [0603R]  36.66 56.96 270 top
R10  10K  [0603R]  53.49 56.96 270 top
R11  10K  [0603R]  55.12 36.3 90 top
R12  10K  [0603R]  45.48 44 90 top
U1  CJ7805  [TO-263-2]  24.16 81.13 180 top
U2  CH340G  [SOIC-16_L9.9-W3.9-P1.27-LS6.0-BL]  81.49 30.54 180 top
U3  1117-3.3  [SOT-223]  26 58.33 180 top
U4  LTV-357T-C  [SOP-4_L4.4-W3.9-P2.54-LS7.0-TL]  17.69 41.15 0 top
U5  STM32F103C8T6/CBT6  [LQFP48]  54.36 46.5 0 top
USB_TTL  USB-B10-BRW  [USB-B-TH_USB-B12-BRW]  93.22 45.99 90 top
Y1  12M  [晶振贴片49SSMD]  76.75 38.14 0 top
Y2  8M  [晶振贴片]  37.93 47.98 270 top

## Footprints (pads in the part's own frame, mm; a bottom-side part is the same pattern mirrored in y, then rotated)
0603C
  rect 0.889x0.889 smd: 1(-0.774,0) 2(0.774,0)
0603LED
  rect 0.9x1 smd: 1(-0.884,-0.017) 2(0.816,-0.017)
0603R
  rect 1x1.1 smd: 1(-0.8,0) 2(0.8,0)
0805C
  rect 1x1.4 smd: 1(-1,0) 2(1,0)
C1206
  rect 1.485x1.728 smd: 1(-1.593,0) 2(1.593,0)
CONN-TH_2P-P5.00_DB2ER-5.0-2P-GN
  rect 2.5x2.5 hole 1.7: 1(-2.5,0)
  round 2.5 hole 1.7: 2(2.5,0)
HDR1X2_CON
  rect 1.6x2 hole 0.9: 1(-1.27,0)
  oval 1.6x2 hole 0.9: 2(1.27,0)
HDR-TH_2P-P2.54-V-M
  rect 1.2x1.2 hole 1.2x0.8: 1(-1.27,0)
  round 1.2 hole 1.2x0.8: 2(1.27,0)
HDR-TH_3P-P2.54-V-M
  rect 1.2x1.2 hole 1.1x0.8: 1(-2.54,0)
  round 1.2 hole 1.1x0.8: 2(0,0) 3(2.54,0)
HDR-TH_5P-P2.54-V-M
  rect 1.7x1.7 hole 1.1: 1(-5.08,0)
  round 1.7 hole 1.1: 2(-2.54,0) 3(0,0) 4(2.54,0) 5(5.08,0)
HDR-TH_7P-P2.54-V-M
  rect 1.7x1.7 hole 1.1: 1(-7.62,0)
  round 1.7 hole 1.1: 2(-5.08,0) 3(-2.54,0) 4(0,0) 5(2.54,0) 6(5.08,0) 7(7.62,0)
KEY-SMD_4P-L6.0-W6.0-P4.50-LS9.0
  rect 1.9x1.3 smd: 1(-4.2,2.25) 2(4.2,2.25) 3(-4.2,-2.25) 4(4.2,-2.25)
LQFP48
  oval 1.8x0.3 smd: 1(-4.3,2.75) 2(-4.3,2.25) 3(-4.3,1.75) 4(-4.3,1.25) 5(-4.3,0.75) 6(-4.3,0.25) 7(-4.3,-0.25) 8(-4.3,-0.75) 9(-4.3,-1.25) 10(-4.3,-1.75) 11(-4.3,-2.25) 12(-4.3,-2.75) 25(4.3,-2.75) 26(4.3,-2.25) 27(4.3,-1.75) 28(4.3,-1.25) 29(4.3,-0.75) 30(4.3,-0.25) 31(4.3,0.25) 32(4.3,0.75) 33(4.3,1.25) 34(4.3,1.75) 35(4.3,2.25) 36(4.3,2.75)
  oval 0.3x1.8 smd: 13(-2.75,-4.3) 14(-2.25,-4.3) 15(-1.75,-4.3) 16(-1.25,-4.3) 17(-0.75,-4.3) 18(-0.25,-4.3) 19(0.25,-4.3) 20(0.75,-4.3) 21(1.25,-4.3) 22(1.75,-4.3) 23(2.25,-4.3) 24(2.75,-4.3) 37(2.75,4.3) 38(2.25,4.3) 39(1.75,4.3) 40(1.25,4.3) 41(0.75,4.3) 42(0.25,4.3) 43(-0.25,4.3) 44(-0.75,4.3) 45(-1.25,4.3) 46(-1.75,4.3) 47(-2.25,4.3) 48(-2.75,4.3)
SIP4
  rect 1.2x1.2 hole 0.8: 1(0,0)
  round 1.2 hole 0.8: 2(2.54,0) 3(5.08,0) 4(7.62,0)
SMA
  rect 2x2 smd: 1(2.1,0) 2(-2.1,0)
SOD-523_L1.2-W0.8-LS1.6-BI
  rect 0.6x0.6 smd: 1(-0.75,0) 2(0.75,0)
SOD-523_L1.2-W0.8-LS1.6-BI#2
  rect 0.6x0.4 smd: 1(-0.75,0) 2(0.75,0)
SOIC-16_L9.9-W3.9-P1.27-LS6.0-BL
  oval 0.602x1.971 smd: 1(-4.445,-2.736) 2(-3.175,-2.736) 3(-1.905,-2.736) 4(-0.635,-2.736) 5(0.635,-2.736) 6(1.905,-2.736) 7(3.175,-2.736) 8(4.445,-2.736) 9(4.445,2.736) 10(3.175,2.736) 11(1.905,2.736) 12(0.635,2.736) 13(-0.635,2.736) 14(-1.905,2.736) 15(-3.175,2.736) 16(-4.445,2.736)
SOP-4_L4.4-W3.9-P2.54-LS7.0-TL
  oval 1.55x0.7 smd: 1(-3.2,1.27) 2(-3.2,-1.27) 3(3.2,-1.27) 4(3.2,1.27)
SOT-223
  rect 1.1x1.6 smd: 1(-2.3,-2.7) 2(0,-2.7) 3(2.3,-2.7)
  rect 3.6x2 smd: 4(0,2.8)
TO-263-2
  rect 3x1.5 smd: 1(0,-2.54) 3(0,2.54)
  rect 10x10.1 smd: 2(-10,0)
USB-B-TH_USB-B12-BRW
  round 1.6 hole 1: 1(12.172,12.268) 2(9.672,12.268) 3(9.672,9.068) 4(12.172,9.068)
  round 3.5 hole 2.5: 5(4.902,9.768) 6(16.942,9.768)
晶振贴片
  rect 3x1.5 smd: 1(-5,0) 2(5,0)
晶振贴片49SSMD
  rect 2.5x1 smd: 1(-2.8,0) 2(2.8,0)
电解电容贴片6X6
  rect 3x1 smd: 1(-2.8,0) 2(2.8,0)

## Nets
As in the schematic, except:
SGND: C1.2 C2.1 C3.2 C4.1 C5.1 C6.2 C8.1 C9.1 C10.1 C11.2 C12.2 C13.2 C14.2 C15.1 C16.1 C17.1 C18.1 D3.1 D4.2 D5.1 D6.2 D8.1 H1.1 H3.1 H3.2 H7.2 K1.1 K1.2 P1.1 P2.1 P3.2 P4.1 P5.1 R10.1 R11.1 U1.2 U2.1 U3.1 U4.3 U5.8 U5.23 U5.35 U5.47 USB_TTL.4 USB_TTL.5 USB_TTL.6
USB_DM: U2.6 USB_TTL.2
USB_DP: U2.5 USB_TTL.3
VUSB: D1.1 USB_TTL.1

Pads without a net: U2 9 10 11 12 14 15; U5 1

## Via types
v1: diameter 0.6, hole 0.3, Top Layer to Bottom Layer, 598 vias

## Routing (per net, layer and track width the routed paths; a pad name or vN(x,y) marks a point on that pad's centre or on a via; arc(x,y) is an arc through that point)
3V3: length 168.9
  Top Layer w0.254: C17.2 48.99,54.11 50.22,52.88 51.35,52.88 51.61,52.62 U5.48 51.61,45.64 51.22,45.25 U5.9 48.52,45.25 46.47,43.2 R12.1 45.48,40.42 45.44,40.38 ; 68.08,53.45 67.95,53.45 66.12,51.61 C10.2 63.6,51.61 61.24,49.25 U5.36 57.57,49.25 57.11,48.79 U5.24 57.11,40.49 58.23,39.36 59.61,39.36 60.13,38.84 C16.2
  Top Layer w0.5: v1(49,57.72) 49,55.64 C17.2 ; 68.08,53.45 68.13,53.5 v1(68.13,55.68) ; v1(69.44,67.57) R4.1 69.53,71.96 P5.2
  Top Layer w0.8: U3.2 U3.4 26,20.44 29.19,17.25 H7.1 ; 26.1,55.63 C17.2
  Bottom Layer w0.5: v1(68.13,55.68) 69.44,56.99 v1(69.44,67.57) 58.84,67.57 v1(49,57.72)
5V_VCC: length 155.4
  Top Layer w0.5: C5.2 85.78,21.01 78.94,14.17 29.16,14.17 22.89,20.44 22.89,35.79 18.33,40.35 18.33,46.2 20.08,47.94 H1.2 22.85,61.04 22.85,61.03 23.7,61.03
  Top Layer w0.6: v1(85.87,29.77) 85.93,29.72 U2.16 85.93,24.72 C5.2 ; v1(85.67,41.35) 85.67,41.55 D1.2
  Top Layer w0.8: 23.7,61.03 24.16,61.5 U1.3
  Bottom Layer w0.6: v1(85.87,29.77) 85.67,29.98 v1(85.67,41.35)
24V: length 6.4
  Top Layer w0.8: D2.1 12.53,76.64 P2.2
SGND: length 35.8
  Top Layer w0.254: U5.47 52.11,52.99 50.54,54.55 C17.1 ; U5.23 56.61,39.5 58.58,37.53 ; U5.35 61.66,48.75 62.97,50.06 C10.1 67.87,50.06 C8.1 ; D6.2 71.95,74.43 72.02,74.5 P5.1 ; v1(46.81,44.77) 47.79,45.75 U5.8 ; C18.1 43.24,43.13 v1(43.24,42.07)
  Top Layer w0.3: v1(43.24,42.07) 43.24,40.98 C15.1
  Bottom Layer w0.254: v1(46.81,44.77) 44.1,42.07 v1(43.24,42.07)
  vias: v1(2.9,86.94) v1(2.9,85.25) v1(3.41,27.16) v1(3.41,25.48) v1(4.15,86.94) v1(4.15,85.25) v1(4.32,72.86) v1(4.32,71.18) v1(4.66,27.16) v1(4.66,25.48) v1(5.41,86.94) v1(5.41,85.25) v1(5.58,72.86) v1(5.58,71.18) v1(5.92,27.16) v1(5.92,25.48) v1(6.67,86.94) v1(6.67,85.25) v1(6.77,69.29) v1(6.77,67.61) v1(6.84,72.86) v1(6.84,71.18) v1(7.18,27.16) v1(7.18,25.48) v1(8.1,72.86) v1(8.1,71.18) v1(8.03,69.29) v1(8.03,67.61) v1(8.46,65.72) v1(8.46,64.04) v1(8.81,88.26) v1(8.81,86.58) v1(9.29,69.29) v1(9.29,67.61) v1(9.68,25.23) v1(9.68,23.54) v1(9.71,65.72) v1(9.71,64.04) v1(10.07,88.26) v1(10.07,86.58) v1(10.09,61.69) v1(10.09,60.01) v1(10.55,69.29) v1(10.55,67.61) v1(10.97,65.72) v1(10.97,64.04) v1(10.94,25.23) v1(10.94,23.54) v1(11.33,88.26) v1(11.33,86.58) v1(11.35,61.69) v1(11.35,60.01) v1(11.52,91.73) v1(11.52,90.05) v1(12.2,25.23) v1(12.2,23.54) v1(12.23,65.72) v1(12.23,64.04) v1(12.59,88.26) v1(12.59,86.58) v1(12.6,61.69) v1(12.6,60.01) v1(12.77,91.73) v1(12.77,90.05) v1(13.45,25.23) v1(13.45,23.54) v1(13.86,61.69) v1(13.86,60.01) v1(13.86,53.43) v1(13.86,51.75) v1(14.03,91.73) v1(14.03,90.05) v1(15.12,53.43) v1(15.12,51.75) v1(15.29,91.73) v1(15.29,90.05) v1(16.38,53.43) v1(16.38,51.75) v1(16.46,23.29) v1(16.46,21.6) v1(17.64,53.43) v1(17.64,51.75) v1(17.72,23.29) v1(17.72,21.6) v1(17.89,92.9) v1(17.89,91.22) v1(18.3,17.93) v1(18.3,16.25) v1(18.98,23.29) v1(18.98,21.6) v1(19.15,92.9) v1(19.15,91.22) v1(19.56,17.93) v1(19.56,16.25) v1(20.24,23.29) v1(20.24,21.6) v1(20.41,92.9) v1(20.41,91.22) v1(20.81,17.93) v1(20.81,16.25) v1(21.66,92.9) v1(21.66,91.22) v1(21.93,50.58) v1(21.93,49.32) v1(21.93,48.07) v1(21.93,46.81) v1(22.02,89.28) v1(22.02,87.6) v1(22.07,17.93) v1(22.07,16.25) v1(23.28,89.28) v1(23.28,87.6) v1(23.5,12.63) v1(23.5,10.95) v1(23.61,50.58) v1(23.61,49.32) v1(23.61,48.07) v1(23.61,46.81) v1(24.54,89.28) v1(24.54,87.6) v1(24.76,12.63) v1(24.76,10.95) v1(25.8,89.28) v1(25.8,87.6) v1(26.02,12.63) v1(26.02,10.95) v1(27.27,12.63) v1(27.27,10.95) v1(28.25,28.75) v1(28.25,27.5) v1(28.25,26.24) v1(28.25,24.98) v1(28.67,88.67) v1(28.67,86.98) v1(28.75,77.45) v1(28.75,75.77) v1(29.26,78.22) v1(29.26,76.53) v1(29.25,37.8) v1(29.25,36.12) v1(29.57,80.61) v1(29.57,78.93) v1(29.82,84.34) v1(29.82,82.65) v1(29.93,88.67) v1(29.93,86.98) v1(29.94,28.75) v1(29.94,27.5) v1(29.94,26.24) v1(29.94,24.98) v1(30.03,81.48) v1(30.03,79.8) v1(30.01,77.45) v1(30.01,75.77) v1(30.23,48.99) v1(30.44,47.46) v1(30.52,78.22) v1(30.52,76.53) v1(30.51,37.8) v1(30.51,36.12) v1(30.64,63.02) v1(30.79,85.14) v1(30.79,83.46) v1(30.74,64.19) v1(30.83,80.61) v1(30.83,78.93) v1(30.95,65.67) v1(31.08,84.34) v1(31.08,82.65) v1(31.19,88.67) v1(31.19,86.98) v1(31.29,81.48) v1(31.29,79.8) v1(31.27,77.45) v1(31.27,75.77) v1(31.49,48.99) v1(31.69,47.46) v1(31.78,78.22) v1(31.78,76.53) v1(31.77,37.8) v1(31.77,36.12) v1(31.9,63.02) v1(32,64.19) v1(32.05,85.14) v1(32.05,83.46) v1(32.09,80.61) v1(32.09,78.93) v1(32.2,65.67) v1(32.27,12.42) v1(32.27,10.74) v1(32.34,84.34) v1(32.34,82.65) v1(32.44,88.67) v1(32.44,86.98) v1(32.54,81.48) v1(32.54,79.8) v1(32.53,77.45) v1(32.53,75.77) v1(32.58,75.16) v1(32.58,73.47) v1(32.75,48.99) v1(32.95,47.46) v1(33.04,78.22) v1(33.04,76.53) v1(33.03,37.8) v1(33.03,36.12) v1(33.16,63.02) v1(33.26,64.19) v1(33.31,85.14) v1(33.31,83.46) v1(33.34,80.61) v1(33.34,78.93) v1(33.34,70.46) v1(33.34,68.78) v1(33.46,65.67) v1(33.6,84.34) v1(33.6,82.65) v1(33.53,12.42) v1(33.53,10.74) v1(33.65,88.77) v1(33.65,87.09) v1(33.8,81.48) v1(33.8,79.8) v1(33.84,75.16) v1(33.84,73.47) v1(34.01,48.99) v1(34.21,78.73) v1(34.21,77.04) v1(34.21,47.46) v1(34.47,82.09) v1(34.47,80.41) v1(34.41,63.02) v1(34.57,85.14) v1(34.57,83.46) v1(34.6,70.46) v1(34.6,68.78) v1(34.52,64.19) v1(34.72,65.67) v1(34.79,12.42) v1(34.79,10.74) v1(34.82,78.11) v1(34.82,76.43) v1(34.91,88.77) v1(34.91,87.09) v1(35.09,75.16) v1(35.09,73.47) v1(35.13,85.76) v1(35.13,84.08) v1(35.28,81.22) v1(35.28,79.54) v1(35.47,78.73) v1(35.47,77.04) v1(35.54,84.74) v1(35.54,83.06) v1(35.72,82.09) v1(35.72,80.41) v1(35.86,70.46) v1(35.86,68.78) v1(36.08,78.11) v1(36.08,76.43) v1(36.05,12.42) v1(36.05,10.74) v1(36.17,88.77) v1(36.17,87.09) v1(36.39,85.76) v1(36.39,84.08) v1(36.35,75.16) v1(36.35,73.47) v1(36.54,81.22) v1(36.54,79.54) v1(36.66,40.02) v1(36.8,84.74) v1(36.8,83.06) v1(36.73,78.73) v1(36.73,77.04) v1(36.98,82.09) v1(36.98,80.41) v1(37.12,70.46) v1(37.12,68.78) v1(37.34,78.11) v1(37.34,76.43) v1(37.42,88.77) v1(37.42,87.09) v1(37.42,75.21) v1(37.42,73.52) v1(37.64,85.76) v1(37.64,84.08) v1(37.8,81.22) v1(37.8,79.54) v1(37.98,78.73) v1(37.98,77.04) v1(37.92,40.02) v1(38.06,84.74) v1(38.06,83.06) v1(38.24,82.09) v1(38.24,80.41) v1(38.6,78.11) v1(38.6,76.43) v1(38.68,75.21) v1(38.68,73.52) v1(38.9,85.76) v1(38.9,84.08) v1(38.85,38.38) v1(39.06,81.22) v1(39.06,79.54) v1(39.11,88.93) v1(39.11,87.24) v1(39.17,40.02) v1(39.32,84.74) v1(39.32,83.06) v1(39.94,75.21) v1(39.94,73.52) v1(40.08,19.26) v1(40.11,38.38) v1(40.37,88.93) v1(40.37,87.24) v1(40.38,85.71) v1(40.38,84.03) v1(40.48,82.86) v1(40.48,81.17) v1(40.48,79.64) v1(40.48,77.96) v1(40.43,40.02) v1(40.94,51.59) v1(41.2,75.21) v1(41.2,73.52) v1(41.15,52.92) v1(41.37,38.38) v1(41.33,19.26) v1(41.62,88.93) v1(41.62,87.24) v1(41.64,85.71) v1(41.64,84.03) v1(41.74,82.86) v1(41.74,81.17) v1(41.74,79.64) v1(41.74,77.96) v1(42.2,51.59) v1(42.41,52.92) v1(42.59,19.26) v1(42.63,38.38) v1(42.88,88.93) v1(42.88,87.24) v1(42.9,85.71) v1(42.9,84.03) v1(43,82.86) v1(43,81.17) v1(43,79.64) v1(43,77.96) v1(43.46,51.59) v1(43.66,52.92) v1(43.8,12.42) v1(43.8,10.74) v1(43.85,19.26) v1(44.16,85.71) v1(44.16,84.03) v1(44.26,82.86) v1(44.26,81.17) v1(44.26,79.64) v1(44.26,77.96) v1(44.72,51.59) v1(44.92,52.92) v1(45.06,12.42) v1(45.06,10.74) v1(46.31,12.42) v1(46.31,10.74) v1(47.57,12.42) v1(47.57,10.74) v1(48.24,81.89) v1(48.24,80.2) v1(48.85,51.08) v1(49.49,81.89) v1(49.49,80.2) v1(49.51,51.59) v1(50.75,81.89) v1(50.75,80.2) v1(52.01,81.89) v1(52.01,80.2) v1(52.47,46.9) v1(52.42,45.93) v1(52.52,47.92) v1(53.68,45.93) v1(53.78,47.92) v1(53.73,46.9) v1(54.82,81.73) v1(54.82,80.05) v1(54.99,46.9) v1(54.93,45.93) v1(55.04,47.92) v1(56.07,81.73) v1(56.07,80.05) v1(56.19,45.93) v1(56.14,12.12) v1(56.14,10.44) v1(56.29,47.92) v1(56.24,46.9) v1(57.33,81.73) v1(57.33,80.05) v1(57.4,12.12) v1(57.4,10.44) v1(58.59,81.73) v1(58.59,80.05) v1(58.66,12.12) v1(58.66,10.44) v1(59.2,35.37) v1(59.15,33.84) v1(59.15,32.16) v1(59.92,12.12) v1(59.92,10.44) v1(60.46,35.37) v1(60.41,33.84) v1(60.41,32.16) v1(61.67,33.84) v1(61.67,32.16) v1(61.72,35.37) v1(62.01,81.73) v1(62.01,80.05) v1(62.16,55.01) v1(62.98,35.37) v1(62.92,33.84) v1(62.92,32.16) v1(63.26,81.73) v1(63.26,80.05) v1(63.42,55.01) v1(63.43,49.14) v1(64.45,49.09) v1(64.52,81.73) v1(64.52,80.05) v1(64.68,55.01) v1(65.78,81.73) v1(65.78,80.05) v1(65.93,55.01) v1(66.34,49.09) v1(66.57,49.85) v1(66.8,12.02) v1(66.8,10.33) v1(68.06,12.02) v1(68.06,10.33) v1(69.32,12.02) v1(69.32,10.33) v1(69.5,51.24) v1(69.55,50.37) v1(70.57,12.02) v1(70.57,10.33) v1(70.78,79.29) v1(70.78,77.6) v1(72.04,79.29) v1(72.04,77.6) v1(73.29,79.29) v1(73.29,77.6) v1(73.24,27.32) v1(73.35,26.09) v1(73.8,24.36) v1(74.06,35.07) v1(74.26,34.25) v1(74.5,27.32) v1(74.55,79.29) v1(74.55,77.6) v1(74.6,26.09) v1(75.06,24.36) v1(75.32,35.07) v1(75.52,34.25) v1(77.2,11.76) v1(77.2,10.08) v1(77.36,47.31) v1(77.36,45.63) v1(77.61,78.42) v1(77.61,76.74) v1(77.87,65.52) v1(77.87,63.83) v1(78.02,56.85) v1(78.02,55.16) v1(78.38,73.73) v1(78.38,72.04) v1(78.46,11.76) v1(78.46,10.08) v1(78.62,47.31) v1(78.62,45.63) v1(78.79,69.49) v1(78.79,67.81) v1(78.87,78.42) v1(78.87,76.74) v1(79.13,65.52) v1(79.13,63.83) v1(79.28,56.85) v1(79.28,55.16) v1(79.64,73.73) v1(79.64,72.04) v1(79.72,11.76) v1(79.72,10.08) v1(79.87,47.31) v1(79.87,45.63) v1(80.04,69.49) v1(80.04,67.81) v1(80.13,78.42) v1(80.13,76.74) v1(80.38,65.52) v1(80.38,63.83) v1(80.54,56.85) v1(80.54,55.16) v1(80.89,73.73) v1(80.89,72.04) v1(80.98,52.51) v1(80.98,50.83) v1(80.98,11.76) v1(80.98,10.08) v1(81.13,47.31) v1(81.13,45.63) v1(81.3,69.49) v1(81.3,67.81) v1(81.39,78.42) v1(81.39,76.74) v1(81.64,65.52) v1(81.64,63.83) v1(81.79,56.85) v1(81.79,55.16) v1(82.15,73.73) v1(82.15,72.04) v1(82.25,59.6) v1(82.24,52.51) v1(82.24,50.83) v1(82.56,69.49) v1(82.56,67.81) v1(83.49,52.51) v1(83.49,50.83) v1(83.51,59.6) v1(84.77,59.6) v1(84.75,52.51) v1(84.75,50.83) v1(85.36,16.3) v1(85.36,14.62) v1(86.03,59.6) v1(86.09,55.57) v1(86.09,53.89) v1(86.62,16.3) v1(86.62,14.62) v1(87.35,55.57) v1(87.35,53.89) v1(87.88,16.3) v1(87.88,14.62) v1(88.6,55.57) v1(88.6,53.89) v1(89.14,16.3) v1(89.14,14.62) v1(89.86,55.57) v1(89.86,53.89) v1(89.85,22.93) v1(89.85,21.25) v1(91.11,22.93) v1(91.11,21.25) v1(92.37,22.93) v1(92.37,21.25) v1(93.32,26.35) v1(93.32,24.66) v1(93.63,22.93) v1(93.63,21.25) v1(94.58,26.35) v1(94.58,24.66) v1(95.84,26.35) v1(95.84,24.66) v1(96.8,55.73) v1(96.8,54.48) v1(96.8,53.22) v1(96.8,51.96) v1(96.9,40.18) v1(96.9,38.92) v1(96.9,37.66) v1(96.9,36.4) v1(97.09,26.35) v1(97.09,24.66) v1(98.48,55.73) v1(98.48,54.48) v1(98.48,53.22) v1(98.48,51.96) v1(98.58,40.18) v1(98.58,38.92) v1(98.58,37.66) v1(98.58,36.4)
VIN_24V: length 17.8
  Top Layer w0.4: R1.2 17.08,72.61 D2.2
  Top Layer w0.8: U1.1 18.03,83.67 C3.1 17.08,82.73 D2.2
BLK: length 24.8
  Top Layer w0.254: v1(48.08,35.13) 52.11,39.15 U5.14
  Bottom Layer w0.254: v1(48.08,35.13) 46.83,33.87 H2.5
BOOT0: length 5.4
  Top Layer w0.254: R10.2 53.49,55.4 53.61,55.29 U5.44
BOOT1: length 5.1
  Top Layer w0.254: U5.20 55.11,37.87 55.12,37.86 R11.2
CS: length 25.7
  Top Layer w0.254: H7.6 39.69,29.95 47.57,37.83 47.57,42.68 48.65,43.75 U5.12
DC: length 26.4
  Top Layer w0.254: H7.5 39.5,27.41 51.61,39.52 U5.13
MISO: length 26.1
  Top Layer w0.254: v1(53.13,43.7) 53.11,43.67 U5.16
  Bottom Layer w0.254: v1(53.13,43.7) 53.13,20.8 H2.3
NRST: length 7.4
  Top Layer w0.254: U5.7 46.98,46.25 45.53,44.8 R12.2 43.37,44.8 C18.2
PA0: length 28
  Top Layer w0.254: v1(51.91,44.62) 51.77,44.75 U5.10
  Bottom Layer w0.254: v1(51.91,44.62) 51.96,44.56 51.96,35.23 49.37,32.64 H2.4
PA11: length 16.3
  Top Layer w0.254: U5.32 73.24,47.25 H3.5
PA12: length 17.1
  Top Layer w0.254: U5.33 71.2,47.75 H3.4
PA15: length 20.3
  Top Layer w0.254: v1(57.31,53.64) 56.61,52.93 U5.38
  Bottom Layer w0.254: v1(57.31,53.64) 74.33,53.64 H3.3
PB0: length 23.4
  Top Layer w0.254: U5.18 54.11,38.4 53.29,37.58 53.29,20.74 H2.2
PB1: length 24.3
  Top Layer w0.254: U5.19 54.61,38.18 53.8,37.37 53.8,22.79 55.88,20.7 55.88,20.68 H2.1
PB3: length 28.5
  Top Layer w0.254: H4.5 62.55,61.53 56.11,55.09 U5.39
PB4: length 27.6
  Top Layer w0.254: U5.40 55.61,55.45 60.01,59.85 H4.4
PB5: length 26.8
  Top Layer w0.254: H4.3 57.47,58.74 55.11,56.38 U5.41
PB6: length 25.9
  Top Layer w0.254: U5.42 54.61,76.27 H4.2
PB7: length 29.6
  Top Layer w0.254: v1(53.39,59.86) 53.39,69.91 52.39,70.91 H4.1 ; U5.43 v1(54.11,49.26)
  Bottom Layer w0.254: v1(54.11,49.26) 53.39,49.98 v1(53.39,59.86)
PB8: length 42.4
  Top Layer w0.254: U5.45 53.11,54.38 52.52,54.97 52.52,68.06 H5.5 36.62,64.5 D10.2
PB9: length 36.1
  Top Layer w0.254: D9.2 39.28,64.61 H5.4 51.91,66.13 51.91,54.82 52.61,54.12 U5.46
PB12: length 27.7
  Top Layer w0.254: H6.5 64.73,39.44 60.42,43.75 U5.25
PB13: length 29.6
  Top Layer w0.254: H6.4 67.27,37.87 60.89,44.25 U5.26
PB14: length 31.3
  Top Layer w0.254: U5.27 61.16,44.75 68.13,37.78 68.13,21.26 H6.3
PC13: length 33
  Top Layer w0.254: v1(48.03,54.1) 48.03,49.61 48.89,48.75 U5.2 ; D7.2 42.03,64.83 H5.3
  Bottom Layer w0.254: H5.3 49.66,65.83 49.66,61.75 48.03,60.12 v1(48.03,54.1)
PC14: length 21.8
  Top Layer w0.254: v1(47.22,53.23) 47.22,49.66 48.63,48.25 U5.3
  Bottom Layer w0.254: v1(47.22,53.23) 47.22,60.63 48.54,61.96 48.54,64.41 H5.2
PC15: length 19.4
  Top Layer w0.254: U5.4 47.6,47.75 46.2,49.15 v1(46.2,54.36)
  Bottom Layer w0.254: v1(46.2,54.36) 46.2,62.81 46.35,62.96 H5.1
RES: length 45
  Top Layer w0.254: U5.11 48.18,44.25 46.96,43.03 46.96,39.67 39.78,32.49 H7.7
  Top Layer w0.3: v1(24.62,33.6) 24.13,34.09 R6.2 20.89,42.42 U4.4
  Bottom Layer w0.3: v1(24.62,33.6) 25.73,32.49 H7.7
RST: length 44.8
  Top Layer w0.254: U5.28 61.57,45.25 69.04,37.78 69.04,22.88 H6.2 74.59,17.33 76.85,17.33 80.72,21.21 C7.2
RXD: length 25.7
  Top Layer w0.254: R2.2 71.9,29.99 v1(71.9,31.41) ; U5.31 64.46,46.75 71.9,39.31 v1(71.9,34.62)
  Bottom Layer w0.254: v1(71.9,34.62) v1(71.9,31.41)
RXD1: length 23.2
  Top Layer w0.254: 84.66,32.59 84.66,31.73 82.87,29.93 R2.1 ; 84.66,32.59 U2.2 ; 84.66,32.59 88.18,29.07 P1.3
RXD3: length 17.4
  Top Layer w0.254: P4.2 57.31,29.21 57.31,37.73 56.11,38.94 U5.22
SCL: length 30
  Top Layer w0.254: v1(36.25,25.69) 39.62,25.69 52.61,38.68 U5.15
  Bottom Layer w0.254: v1(36.25,25.69) 32.93,22.37 H7.3
SDA: length 30
  Top Layer w0.254: H7.4 39.86,24.87 53.61,38.61 U5.17
SPINDLE_PWM: length 34.8
  Top Layer w0.254: U5.29 61.94,45.75 69.96,37.73 69.96,24.5 H6.1
SWCLK: length 25.1
  Top Layer w0.254: U5.37 57.11,52.21 60.94,56.04 60.94,57.49 P5.3
SWDIO: length 30.6
  Top Layer w0.254: U5.34 68.96,48.25 70.37,49.66 70.37,64.38 P5.4
TXD: length 21.7
  Top Layer w0.254: R3.2 71.92,32.94 70.78,34.07 70.78,38.9 63.43,46.25 U5.30
TXD1: length 24.8
  Top Layer w0.254: R3.1 73.52,32.84 74.95,31.41 82.41,31.41 83.39,32.39 U2.3 83.39,34.74 84.09,35.44 87.97,35.44 91.79,31.61 P1.2
TXD3: length 16.5
  Top Layer w0.254: U5.21 55.61,38.57 56.5,37.68 56.5,27.49 P4.3
USB_DM: length 18.8
  Top Layer w0.4: U2.6 79.58,35.26 83.53,39.21 87.66,39.21 91.49,43.04 91.49,44.74
USB_DP: length 19.9
  Top Layer w0.4: 94.69,44.74 88.29,38.34 83.68,38.34 80.85,35.51 U2.5
VUSB: length 7.2
  Top Layer w0.6: D1.1 86,47.02 86.22,47.24 91.49,47.24
XTAL1: length 19.3
  Top Layer w0.254: 50.21,47.25 42.84,47.25 37.93,52.16 Y2.1
  Top Layer w0.3: C14.1 36.43,52.53 36.88,52.98 Y2.1
XTAL2: length 18.5
  Top Layer w0.254: 50.21,46.75 40.99,46.75 37.93,43.7 Y2.2
  Top Layer w0.3: C13.1 36.33,43.53 36.88,42.98 Y2.2
$1N53807: length 2.6
  Top Layer w0.254: R9.1 36.62,57.79 D10.1
$1N55881: length 2.4
  Top Layer w0.254: R4.2 67.85,72.07 D6.1
$1N62733: length 2
  Top Layer w0.4: R1.1 16.96,70.81 16.96,68.91
$1N62788: length 2.4
  Top Layer w0.254: R7.1 42.01,60.19 D7.1
$1N65547: length 2.5
  Top Layer w0.254: R8.1 39.28,57.83 D9.1
$1N70398: length 4.9
  Top Layer w0.3: U4.1 14.91,42.42 16.73,44.24 R5.2
$1N71038: length 4.2
  Top Layer w0.4: U2.4 82.12,35.11 C6.1
$1N71041: length 4.5
  Top Layer w0.254: U2.13 82.12,25.19 80.92,23.99 C7.1
$1N71051: length 9.2
  Top Layer w0.4: C11.1 79.61,38.2 79.55,38.14 79.55,37.24 78.31,36.01 U2.7
$1N71052: length 10.4
  Top Layer w0.4: C12.1 73.93,38.15 Y1.1 74.7,38.14 77.04,35.79 U2.8
$1N72249: length 23.4
  Top Layer w0.3: P3.1 12.14,33.34 14.47,35.66 ; U4.2 14.49,37.23 14.47,37.21 K1.3 14.47,35.66 ; 14.47,35.66 K1.4

## Copper pours and planes (outline as drawn; the poured copper is in the pictures)
SGND on Top Layer: -2.56,101.58 102.3,101.58 102.3,-1.69 -2.56,-1.69
SGND on Bottom Layer: -2.36,101.43 101.58,101.43 101.58,-1.54 -2.36,-1.54

Small or netless copper shapes (teardrops, artwork), in the pictures only: 229 on Top Layer, 29 on Bottom Layer

## Text on the board
Top Silkscreen Layer: GND | SDA | SCL | 3V3 | RES | DC | CS | CLK | DIO | TX | RX | SPI   OLED
